# EAGLE design v1-psas-dev-board (EAGLE 6.5.0)

## Sheet 1 of 3: STM
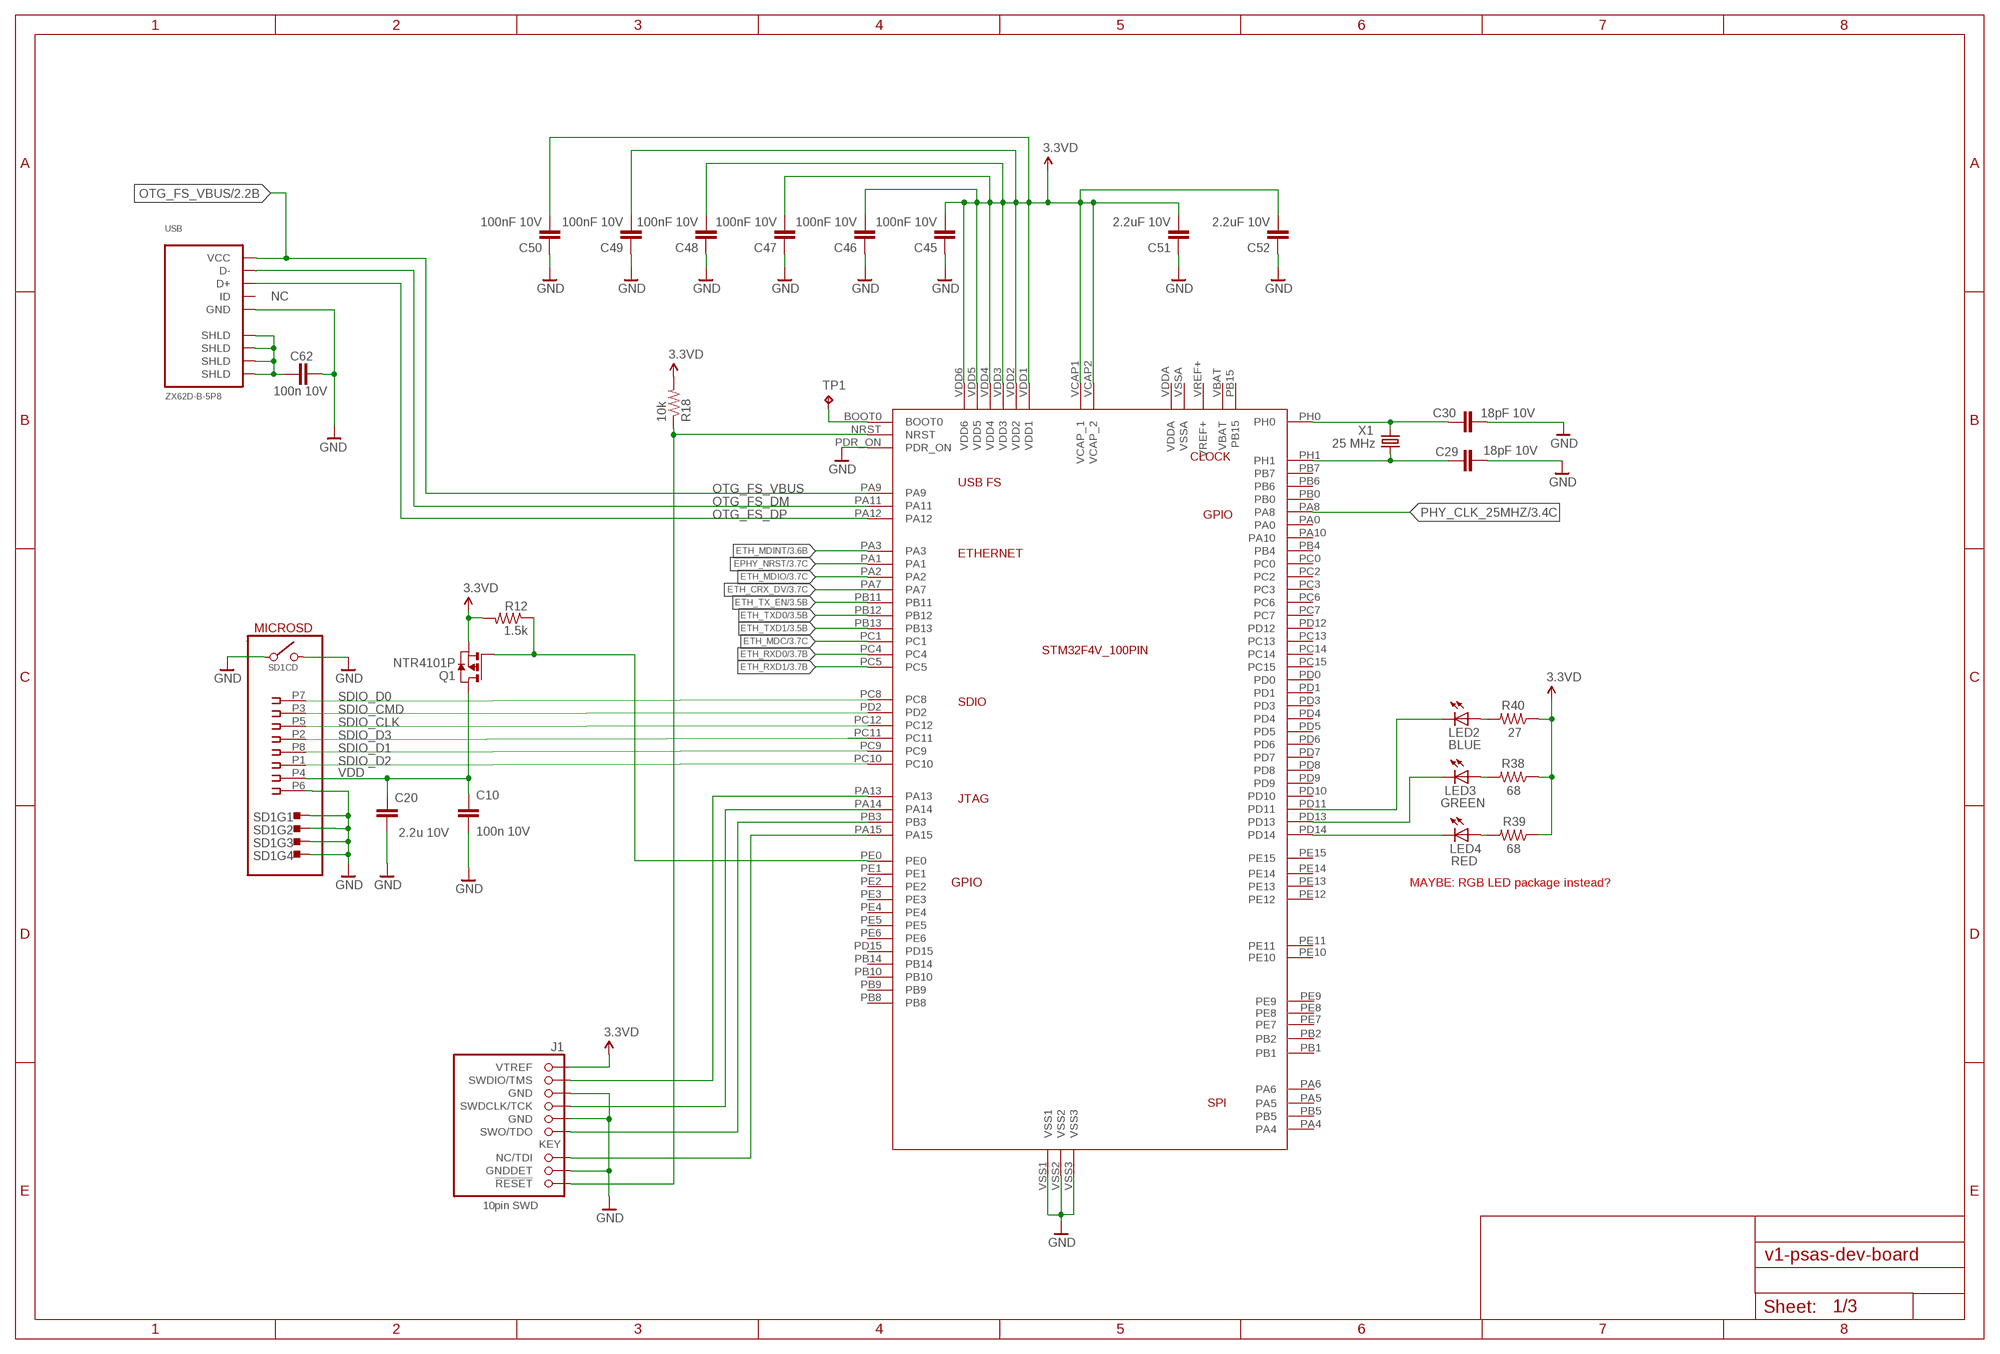
[diagram p0: schematic, sheet 1]

### Parts
C10  100n 10V  C-EU0402-C-NOSILK  [0402-C-NOSILK]
C20  2.2u 10V  C-EU0603-C-NOSILK  [0603-C-NOSILK]
C29  18pF 10V  C-EU0402-C-NOSILK  [0402-C-NOSILK]
C30  18pF 10V  C-EU0402-C-NOSILK  [0402-C-NOSILK]
C45  100nF 10V  C-EU0402-C-NOSILK  [0402-C-NOSILK]
C46  100nF 10V  C-EU0402-C-NOSILK  [0402-C-NOSILK]
C47  100nF 10V  C-EU0402-C-NOSILK  [0402-C-NOSILK]
C48  100nF 10V  C-EU0402-C-NOSILK  [0402-C-NOSILK]
C49  100nF 10V  C-EU0402-C-NOSILK  [0402-C-NOSILK]
C50  100nF 10V  C-EU0402-C-NOSILK  [0402-C-NOSILK]
C51  2.2uF 10V  C-EU0603-C-NOSILK  [0603-C-NOSILK]
C52  2.2uF 10V  C-EU0603-C-NOSILK  [0603-C-NOSILK]
C62  100n 10V  C-EU0402-C-NOSILK  [0402-C-NOSILK]
J1  1.27MM-SWD-CONNECTOR  [1.27MM_2X5]
LED2  BLUE  LEDCHIP-LED0603  [CHIP-LED0603]
LED3  GREEN  LEDCHIP-LED0603  [CHIP-LED0603]
LED4  RED  LEDCHIP-LED0603  [CHIP-LED0603]
Q1  NTR4101P  [SOT23]
R12  1.5k  R-US_0402-C-NOSILK  [0402-C-NOSILK]
R18  10k  R-US_0402-C-NOSILK  [0402-C-NOSILK]
R38  68  R-US_0402-C-NOSILK  [0402-C-NOSILK]
R39  68  R-US_0402-C-NOSILK  [0402-C-NOSILK]
R40  27  R-US_0402-C-NOSILK  [0402-C-NOSILK]
SD1  CON_HIROSE_DM3D(MICROSD)  [HIROSE_DM3D(MICRO-SD)]
TP1  TPTP06R  [TP06R]
U8  STM32F4V  STM32F4V_100PIN_GPSBOARD  [LQFP100]
USB  ZX62D-B-5P8  [ZX62D-B-5P8]
X1  25 MHz  CRYSTALCTS406  [CTS406]

### Nets
3.3VD: C45.2 C46.2 C47.2 C48.2 C49.2 C50.2 C51.2 C52.2 J1.VTREF Q1.2(S) R12.2 R18.2 R38.1 R39.1 R40.1 U8.VCAP1(VCAP_1) U8.VCAP2(VCAP_2) U8.VDD1 U8.VDD2 U8.VDD3 U8.VDD4 U8.VDD5 U8.VDD6 ; also sheet 2,3
!RST: J1.!RESET R18.1 U8.NRST
EPHY_NRST: U8.PA1 ; also sheet 3
ETH_CRX_DV: U8.PA7 ; also sheet 3
ETH_MDC: U8.PC1 ; also sheet 3
ETH_MDINT: U8.PA3 ; also sheet 3
ETH_MDIO: U8.PA2 ; also sheet 3
ETH_RXD0: U8.PC4 ; also sheet 3
ETH_RXD1: U8.PC5 ; also sheet 3
ETH_TX_EN: U8.PB11 ; also sheet 3
ETH_TXD0: U8.PB12 ; also sheet 3
ETH_TXD1: U8.PB13 ; also sheet 3
GND: C10.1 C20.1 C29.1 C30.1 C45.1 C46.1 C47.1 C48.1 C49.1 C50.1 C51.1 C52.1 C62.1 J1.GND J1.GND@2(GND) J1.GNDDET SD1.G1(PAD) SD1.G2(PAD) SD1.G3(PAD) SD1.G4(PAD) SD1.P6 SD1.S0 SD1.S1 U8.PDR_ON U8.VSS1 U8.VSS2 U8.VSS3 USB.P5(GND) ; also sheet 2,3
LED2: LED2.C U8.PD11
LED3: LED3.C U8.PD13
LED4: LED4.C U8.PD14
N$2: LED4.A R39.2
N$3: LED3.A R38.2
N$4: LED2.A R40.2
N$9: TP1.TP U8.BOOT0
OSC_IN: C30.2 U8.PH0 X1.3
OSC_OUT: C29.2 U8.PH1 X1.1
OTG_FS_DM: U8.PA11 USB.P2(D-)
OTG_FS_DP: U8.PA12 USB.P3(D+)
OTG_FS_VBUS: U8.PA9 USB.P1(VCC) ; also sheet 2
PE0: Q1.1(G) R12.1 U8.PE0
PHY_CLK_25MHZ: U8.PA8 ; also sheet 3
SDIO_CLK: SD1.P5 U8.PC12
SDIO_CMD: SD1.P3 U8.PD2
SDIO_D0: SD1.P7 U8.PC8
SDIO_D1: SD1.P8 U8.PC9
SDIO_D2: SD1.P1 U8.PC10
SDIO_D3: SD1.P2 U8.PC11
SHLD: C62.2 USB.P$1(SHLD) USB.P$2(SHLD) USB.P$3(SHLD) USB.P$4(SHLD)
TCK: J1.SWDCLK(SWDCLK/TCK) U8.PA14
TDI: J1.NC(NC/TDI) U8.PA15
TDO: J1.SWO(SWO/TDO) U8.PB3
TMS: J1.SWDIO(SWDIO/TMS) U8.PA13
VDD: C10.2 C20.2 Q1.3(D) SD1.P4
Unconnected: U8.PA0 U8.PA4 U8.PA5 U8.PA6 U8.PA10 U8.PB0 U8.PB1 U8.PB2 U8.PB4 U8.PB5 U8.PB6 U8.PB7 U8.PB8 U8.PB9 U8.PB10 U8.PB14 U8.PB15 U8.PC0 U8.PC2 U8.PC3 U8.PC6 U8.PC7 U8.PC13 U8.PC14 U8.PC15 U8.PD0 U8.PD1 U8.PD3 U8.PD4 U8.PD5 U8.PD6 U8.PD7 U8.PD8 U8.PD9 U8.PD10 U8.PD12 U8.PD15 U8.PE1 U8.PE2 U8.PE3 U8.PE4 U8.PE5 U8.PE6 U8.PE7 U8.PE8 U8.PE9 U8.PE10 U8.PE11 U8.PE12 U8.PE13 U8.PE14 U8.PE15 U8.VBAT U8.VDDA U8.VREF+ U8.VSSA USB.P4(ID)

### Notes on the sheet
- NC
- MICROSD
- MAYBE: RGB LED package instead?

## Sheet 2 of 3: PWR
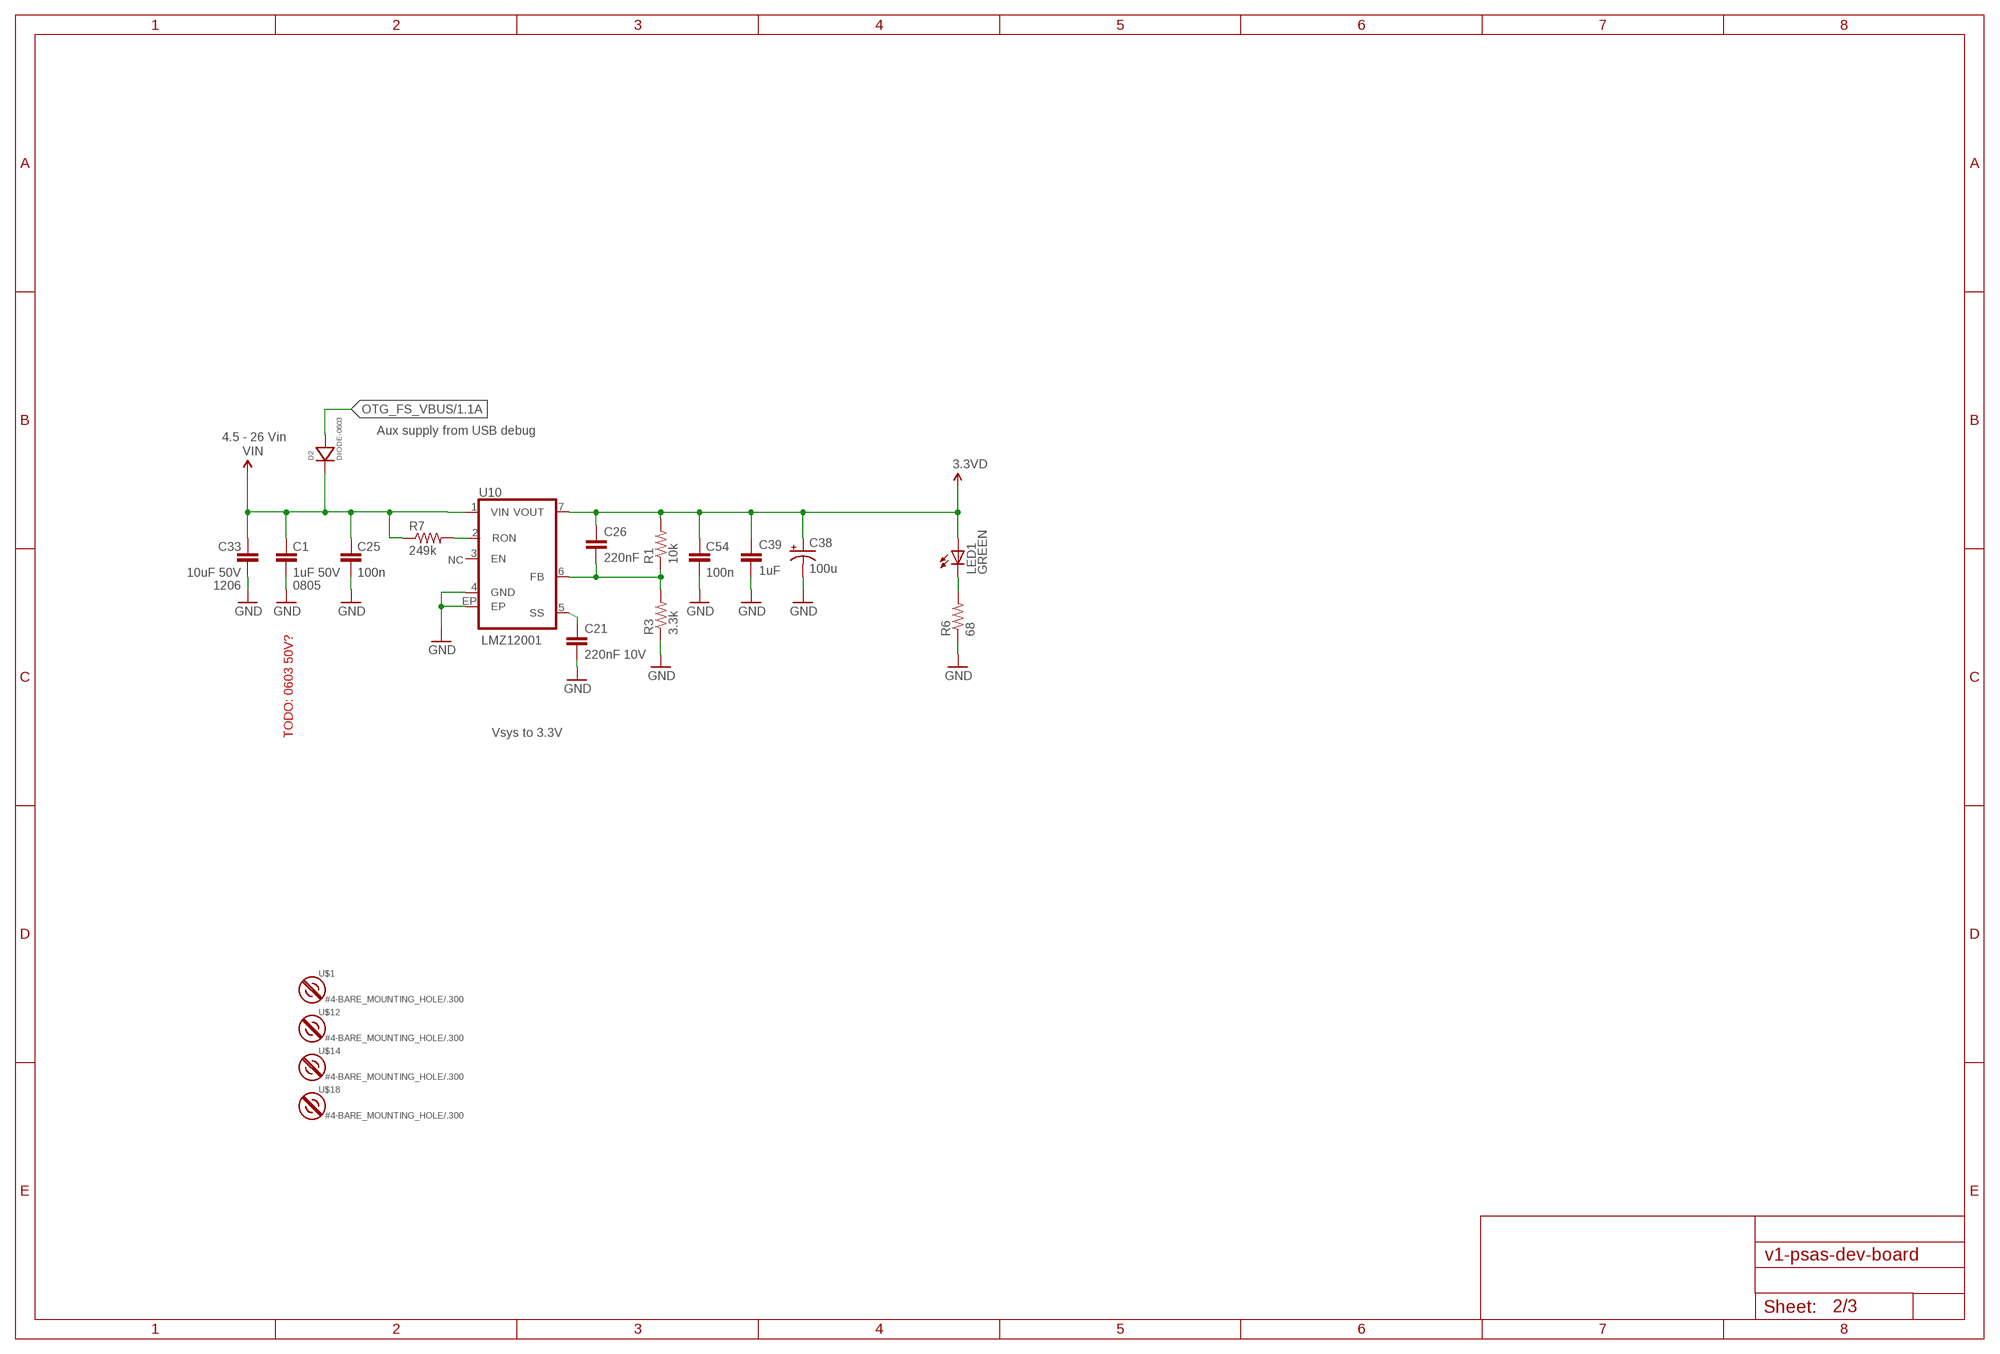
[diagram p1: schematic, sheet 2]

### Parts
C1  1uF 50V  C-EU0805-B-NOSILK  [0805-B-NOSILK]
C21  220nF 10V  C-EU0402-C-NOSILK  [0402-C-NOSILK]
C25  100n  C-EU0402-B-NOSILK  [0402-B-NOSILK]
C26  220nF  C-EU0402-C-NOSILK  [0402-C-NOSILK]
C33  10uF 50V  C-EU1206-C  [1206-C]
C38  100u  CAP_POL6032  [EIA6032]
C39  1uF  C-EU0603-B-NOSILK  [0603-B-NOSILK]
C54  100n  C-EU0402-B-NOSILK  [0402-B-NOSILK]
D2  DIODE-0603  [0603-B-NOSILK-DIODE]
LED1  GREEN  LEDCHIP-LED0603  [CHIP-LED0603]
R1  10k  R-US_0402-C-NOSILK  [0402-C-NOSILK]
R3  3.3k  R-US_0402-C-NOSILK  [0402-C-NOSILK]
R6  68  R-US_0402-C-NOSILK  [0402-C-NOSILK]
R7  249k  R-US_0402-C-NOSILK  [0402-C-NOSILK]
U10  LMZ12001  [TO-PMOD-7]
U$1  #4-BARE_MOUNTING_HOLE/.300  [#4/.300-BARE+STD_NUT_OR_STAR_WASHER]
U$12  #4-BARE_MOUNTING_HOLE/.300  [#4/.300-BARE+STD_NUT_OR_STAR_WASHER]
U$14  #4-BARE_MOUNTING_HOLE/.300  [#4/.300-BARE+STD_NUT_OR_STAR_WASHER]
U$18  #4-BARE_MOUNTING_HOLE/.300  [#4/.300-BARE+STD_NUT_OR_STAR_WASHER]

### Nets
3.3VD: C26.1 C38.P$1(+) C39.1 C54.1 LED1.A R1.2 U10.7(VOUT) ; also sheet 1,3
GND: C1.2 C21.2 C25.2 C33.2 C38.P$2(-) C39.2 C54.2 R3.1 R6.1 U10.4(GND) U10.EP ; also sheet 1,3
N$6: C21.1 U10.5(SS)
N$7: C26.2 R1.1 R3.2 U10.6(FB)
N$10: R7.2 U10.2(RON)
N$19: LED1.C R6.2
OTG_FS_VBUS: D2.ANODE ; also sheet 1
VIN: C1.1 C25.1 C33.1 D2.CATHODE R7.1 U10.1(VIN) ; also sheet 3
Unconnected: U10.3(EN)

### Notes on the sheet
- Aux supply from USB debug
- 4.5 - 26 Vin
- NC
- 1206 | 0805
- TODO: 0603 50V? | Vsys to 3.3V

## Sheet 3 of 3: ETH
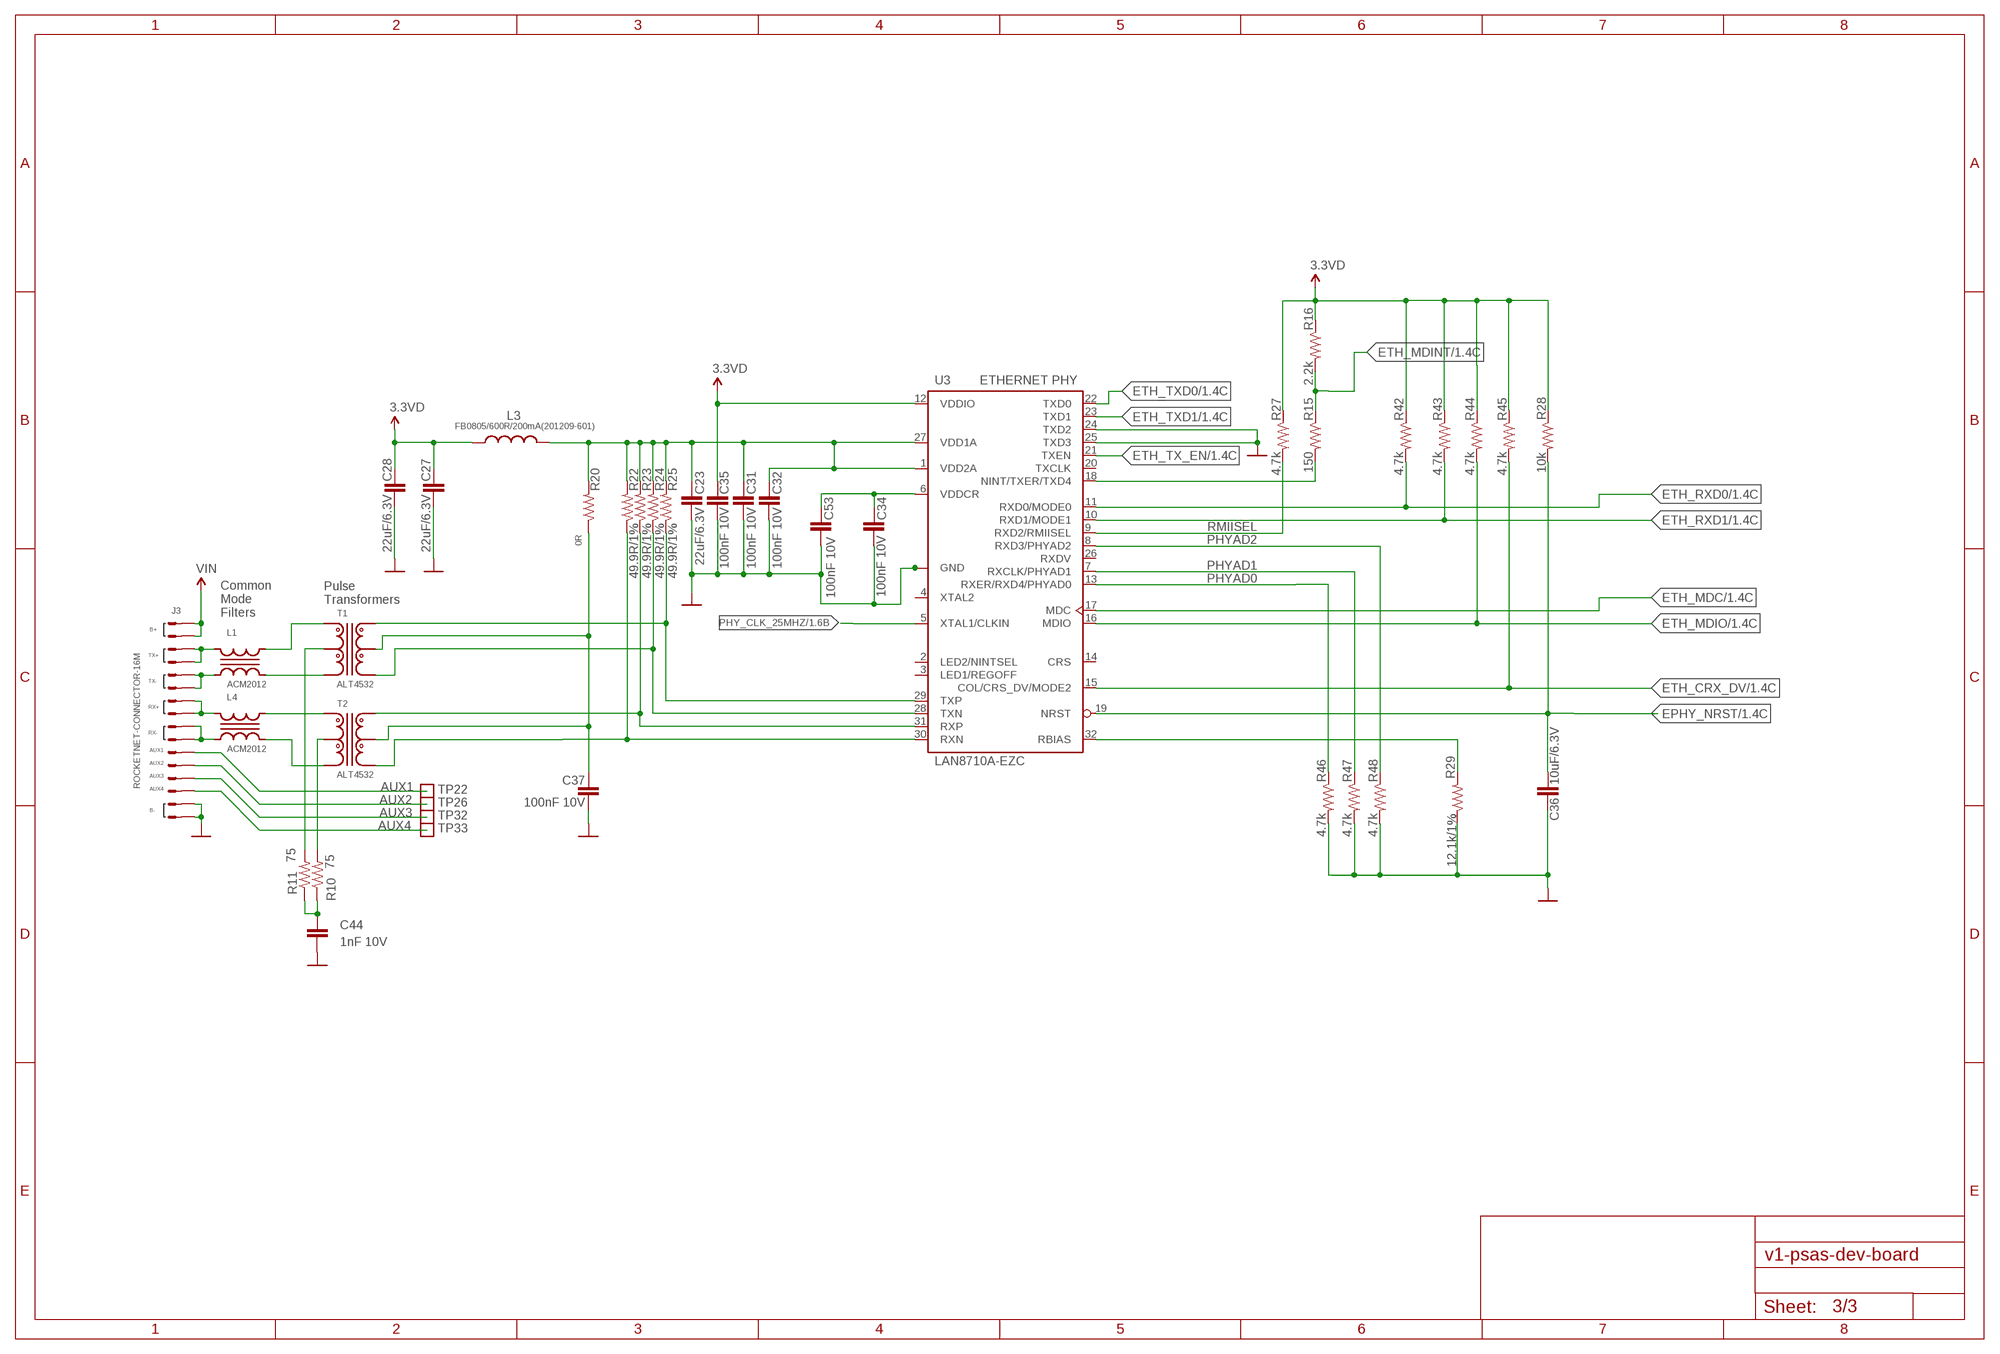
[diagram p2: schematic, sheet 3]

### Parts
C23  22uF/6.3V  C-EU1206-C  [1206-C]
C27  22uF/6.3V  C-EU1206-C  [1206-C]
C28  22uF/6.3V  C-EU1206-C  [1206-C]
C31  100nF 10V  C-EU0402-C-NOSILK  [0402-C-NOSILK]
C32  100nF 10V  C-EU0402-C-NOSILK  [0402-C-NOSILK]
C34  100nF 10V  C-EU0402-C-NOSILK  [0402-C-NOSILK]
C35  100nF 10V  C-EU0402-C-NOSILK  [0402-C-NOSILK]
C36  10uF/6.3V  C-EU1206-C  [1206-C]
C37  100nF 10V  C-EU0402-C-NOSILK  [0402-C-NOSILK]
C44  1nF 10V  C-EU0402-C-NOSILK  [0402-C-NOSILK]
C53  100nF 10V  C-EU0402-C-NOSILK  [0402-C-NOSILK]
J3  ROCKETNET-CONNECTOR-16M  [ROCKETNET-M-16]
L1  ACM2012  [TDK-ACM2012]
L3  FB0805/600R/200mA(201209-601)  L-US0805-C-NOSILK  [0805-C-NOSILK]
L4  ACM2012  [TDK-ACM2012]
R10  75  R-US_0402-C-NOSILK  [0402-C-NOSILK]
R11  75  R-US_0402-C-NOSILK  [0402-C-NOSILK]
R15  150  R-US_0402-C-NOSILK  [0402-C-NOSILK]
R16  2.2k  R-US_0402-C-NOSILK  [0402-C-NOSILK]
R20  0R  R-US_0402-C-NOSILK  [0402-C-NOSILK]
R22  49.9R/1%  R-US_0402-C-NOSILK  [0402-C-NOSILK]
R23  49.9R/1%  R-US_0402-C-NOSILK  [0402-C-NOSILK]
R24  49.9R/1%  R-US_0402-C-NOSILK  [0402-C-NOSILK]
R25  49.9R/1%  R-US_0402-C-NOSILK  [0402-C-NOSILK]
R27  4.7k  R-US_0402-C-NOSILK  [0402-C-NOSILK]
R28  10k  R-US_0402-C-NOSILK  [0402-C-NOSILK]
R29  12.1k/1%  R-US_0402-C-NOSILK  [0402-C-NOSILK]
R42  4.7k  R-US_0402-C-NOSILK  [0402-C-NOSILK]
R43  4.7k  R-US_0402-C-NOSILK  [0402-C-NOSILK]
R44  4.7k  R-US_0402-C-NOSILK  [0402-C-NOSILK]
R45  4.7k  R-US_0402-C-NOSILK  [0402-C-NOSILK]
R46  4.7k  R-US_0402-C-NOSILK  [0402-C-NOSILK]
R47  4.7k  R-US_0402-C-NOSILK  [0402-C-NOSILK]
R48  4.7k  R-US_0402-C-NOSILK  [0402-C-NOSILK]
T1  ALT4532  [TDK-ALT4532]
T2  ALT4532  [TDK-ALT4532]
TP22  TEST-POINT  [2MM-TEST-POINT]
TP26  TEST-POINT  [2MM-TEST-POINT]
TP32  TEST-POINT  [2MM-TEST-POINT]
TP33  TEST-POINT  [2MM-TEST-POINT]
U3  LAN8710A-EZC  [QFN-32(DRILLS)]

### Nets
3.3VD: C27.2 C28.2 C35.1 L3.2 R16.1 R27.1 R28.1 R42.1 R43.1 R44.1 R45.1 U3.12(VDDIO) ; also sheet 1,2
AUX1: J3.A1(AUX1) TP22.1
AUX2: J3.A2(AUX2) TP26.1
AUX3: J3.A3(AUX3) TP32.1
AUX4: J3.A4(AUX4) TP33.1
EPHY_NRST: C36.2 R28.2 U3.19(NRST) ; also sheet 1
ETH_CRX_DV: R45.2 U3.15(COL/CRS_DV/MODE2) ; also sheet 1
ETH_MDC: U3.17(MDC) ; also sheet 1
ETH_MDINT: R15.1 R16.2 ; also sheet 1
ETH_MDIO: R44.2 U3.16(MDIO) ; also sheet 1
ETH_RXD0: R42.2 U3.11(RXD0/MODE0) ; also sheet 1
ETH_RXD1: R43.2 U3.10(RXD1/MODE1) ; also sheet 1
ETH_TX_EN: U3.21(TXEN) ; also sheet 1
ETH_TXD0: U3.22(TXD0) ; also sheet 1
ETH_TXD1: U3.23(TXD1) ; also sheet 1
GND: C23.1 C27.1 C28.1 C31.1 C32.1 C34.1 C35.2 C36.1 C37.1 C44.1 C53.1 J3.B-@1(B-) J3.B-@2(B-) R29.1 R46.2 R47.2 R48.2 U3.24(TXD2) U3.25(TXD3) U3.GND ; also sheet 1,2
N$8: J3.T+@13(TX+) J3.T+@14(TX+) L1.1
N$15: C44.2 R10.1 R11.1
N$20: J3.T-@9(TX-) J3.T-@11(TX-) L1.2
N$26: J3.R+@5(RX+) J3.R+@7(RX+) L4.1
N$27: J3.R-@3(RX-) J3.R-@4(RX-) L4.2
N$28: L1.4 T1.1
N$29: L1.3 T1.2
N$30: L4.4 T2.1
N$31: L4.3 T2.2
N$32: R11.2 T1.6
N$33: R10.2 T2.6
N$40: R22.1 T2.4 U3.30(RXN)
N$41: R25.1 T1.5 U3.29(TXP)
N$42: R24.1 T1.4 U3.28(TXN)
N$44: R23.1 T2.5 U3.31(RXP)
N$55: R29.2 U3.32(RBIAS)
N$56: C37.2 R20.1 T1.3 T2.3
N$58: C34.2 C53.2 U3.6(VDDCR)
N$63: R15.2 U3.18(NINT/TXER/TXD4)
PHY_CLK_25MHZ: U3.5(XTAL1/CLKIN) ; also sheet 1
PHYAD0: R46.1 U3.13(RXER/RXD4/PHYAD0)
PHYAD1: R47.1 U3.7(RXCLK/PHYAD1)
PHYAD2: R48.1 U3.8(RXD3/PHYAD2)
RMIISEL: R27.2 U3.9(RXD2/RMIISEL)
VDDA: C23.2 C31.2 C32.2 L3.1 R20.2 R22.2 R23.2 R24.2 R25.2 U3.1(VDD2A) U3.27(VDD1A)
VIN: J3.B+@15(B+) J3.B+@16(B+) ; also sheet 2
Unconnected: U3.2(LED2/NINTSEL) U3.3(LED1/REGOFF) U3.4(XTAL2) U3.14(CRS) U3.20(TXCLK) U3.26(RXDV)

### Notes on the sheet
- ETHERNET PHY
- Pulse
  Transformers
- Common 
  Mode
  Filters
- The PHY is setted up as follows:
- MODE: All capable(10/100Base).
- Auto-negotiation enabled.
- RMII Configuration
- SMI address: 0x00

## Library data of the parts
C1 C10 C20 C21 C23 C25-C37 C39 C44-C54 C62 = rcl_custom:C-EU: CAPACITOR, European symbol
C38 = SparkFun-Passives:CAP_POL: Capacitor Polarized These are standard SMD and PTH capacitors. Normally 10uF, 47uF, and 100uF in electrolytic and tantalum varieties. Always verify the external diameter of the through hole cap, it varies with capacity, voltage, and manufacturer. The EIA devices should be standard.
D2 = diode-0603:DIODE-0603
J1 = con-swd:1.27MM-SWD-CONNECTOR
J3 = rocketnet-connector:ROCKETNET-CONNECTOR-16
L1 L4 = magnetics:ACM2012
L3 = rcl_custom:L-US: INDUCTOR, American symbol
LED1-LED4 = led:LED: LED OSRAM: - CHIPLED LG R971, LG N971, LY N971, LG Q971, LY Q971, LO R971, LY R971 LH N974, LH R974 LS Q976, LO Q976, LY Q976 LO Q996 - Hyper CHIPLED LW Q18S LB Q993, LB Q99A, LB R99A - SideLED LS A670, LO A670, LY A670, LG A670, LP A670 LB A673, LV A673, LT A673, LW A673 LH A674 LY A675 LS A676, LA A676, LO A676, LY A676, LW A676 LS A679, LY A679, LG A679 - Hyper Micro SIDELED® LS Y876, LA Y876, LO Y876, LY Y876 LT Y87S - SmartLED LW L88C, LW L88S LB L89C, LB L89S, LG L890 LS L89K, LO L89K, LY L89K LS L896, LA L896, LO L896, LY L896 - TOPLED LS T670, LO T670, LY T670, LG T670, LP T670 LSG T670, LSP T670, LSY T670, LOP T670, LYG T670 LG T671, LOG T671, LSG T671 LB T673, LV T673, LT T673, LW T673 LH T674 LS T676, LA T676, LO T676, LY T676, LB T676, LH T676, LSB T676, LW T676 LB T67C, LV T67C, LT T67C, LS T67K, LO T67K, LY T67K, LW E67C LS E67B, LA E67B, LO E67B, LY E67B, LB E67C, LV E67C, LT E67C LW T67C LS T679, LY T679, LG T679 LS T770, LO T770, LY T770, LG T770, LP T770 LB T773, LV T773, LT T773, LW T773 LH T774 LS E675, LA E675, LY E675, LS T675 LS T776, LA T776, LO T776, LY T776, LB T776 LHGB T686 LT T68C, LB T68C - Hyper Mini TOPLED® LB M676 - Mini TOPLED Santana® LG M470 LS M47K, LO M47K, LY M47K Source: http://www.osram.convergy.de LUXEON: - LUMILED® LXK2-PW12-R00, LXK2-PW12-S00, LXK2-PW14-U00, LXK2-PW14-V00 LXK2-PM12-R00, LXK2-PM12-S00, LXK2-PM14-U00 LXK2-PE12-Q00, LXK2-PE12-R00, LXK2-PE12-S00, LXK2-PE14-T00, LXK2-PE14-U00 LXK2-PB12-K00, LXK2-PB12-L00, LXK2-PB12-M00, LXK2-PB14-N00, LXK2-PB14-P00, LXK2-PB14-Q00 LXK2-PR12-L00, LXK2-PR12-M00, LXK2-PR14-Q00, LXK2-PR14-R00 LXK2-PD12-Q00, LXK2-PD12-R00, LXK2-PD12-S00 LXK2-PH12-R00, LXK2-PH12-S00 LXK2-PL12-P00, LXK2-PL12-Q00, LXK2-PL12-R00 Source: www.luxeon.com KINGBRIGHT: KA-3528ASYC Source: www.kingbright.com
Q1 = Tova:NTR4101P
R1 R3 R6 R7 R10-R12 R15 R16 R18 R20 R22-R25 R27-R29 R38-R40 R42-R48 = rcl_custom:R-US_: RESISTOR, American symbol
SD1 = con-usd-hirose-dm3-gpsboard:CON_HIROSE_DM3*: Hirose μSD card socket without ejection mechanism. Approx 12x12 mm
T1 T2 = magnetics:ALT4532
TP1 = testpad:TP: Test pad
TP22 TP26 TP32 TP33 = Tova:TEST-POINT
U3 = OLIMEX_IC:LAN8710A: LAN8710A/LAN8710Ai Small Footprint MII/RMII 10/100 Ethernet Transceiver with HP Auto-MDIX and flexPWR® Technology
U8 = stm32f4:STM32F4V_100PIN_GPSBOARD: Custom symbol of 100-pin STM32F407 for GPS RF front-end board. Standard LQFP100 package.
U10 = SparkFun-PowerIC:LMZ12001
U$1 U$12 U$14 U$18 = mount:#4-BARE_MOUNTING_HOLE: 1/8" drill hole for #4 screw mount
USB = con-hirose-microusb:ZX62D-B-5P8
X1 = crystal:CRYSTAL: CRYSTAL; OC_FARNELL: unknown; OC_NEWARK: unknown

## Net classes
2 thin: width 0.025 mm, clearance 0.025 mm

## Board
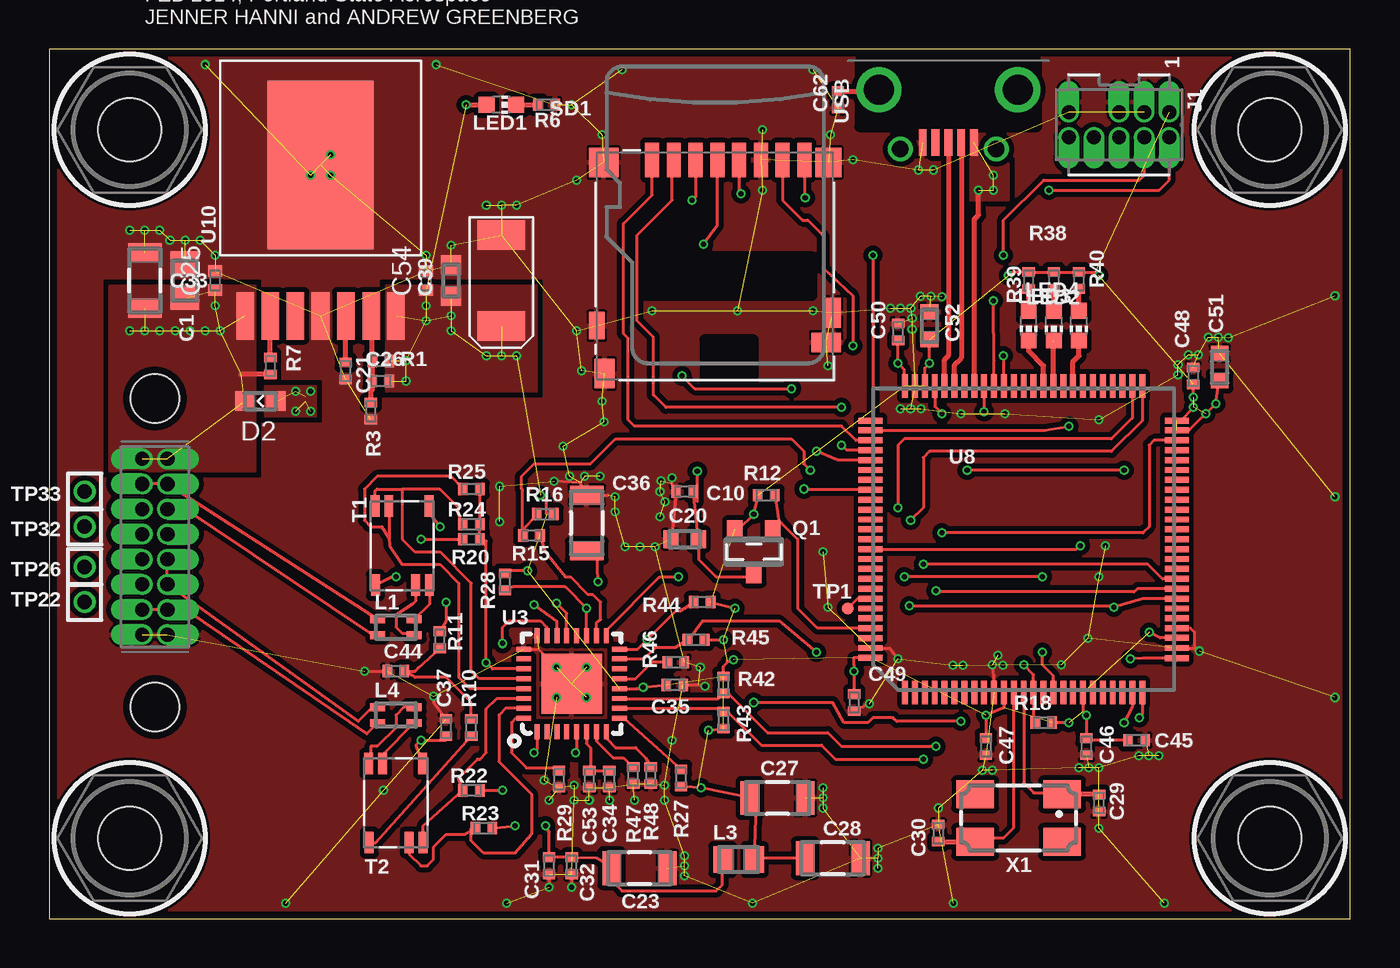
[diagram p3: board, top side]
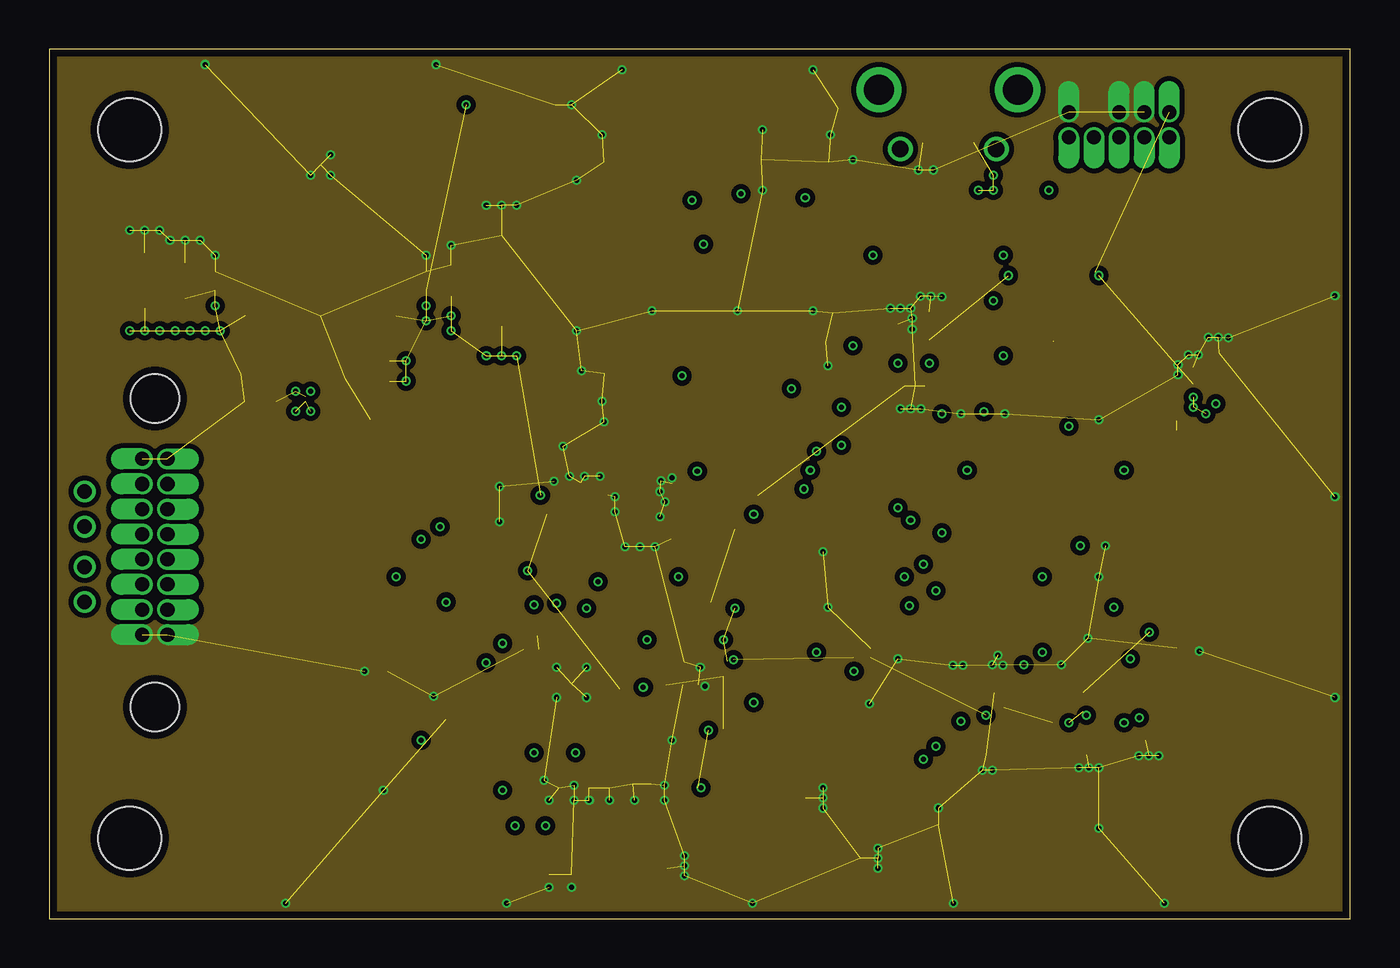
[diagram p4: board, inner layer GND]
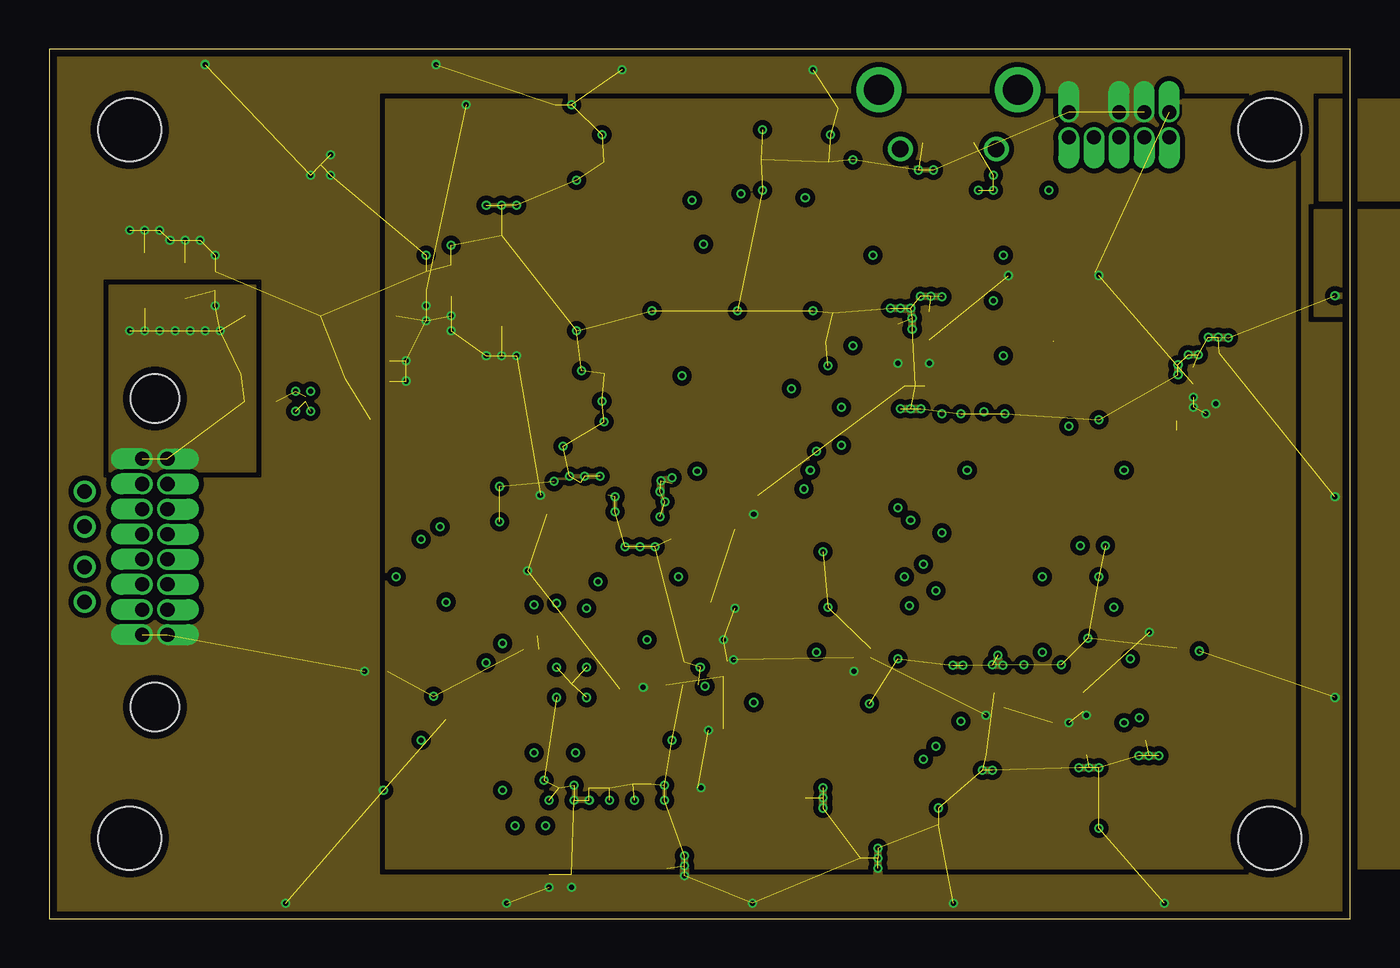
[diagram p5: board, inner layer SUPPLY]
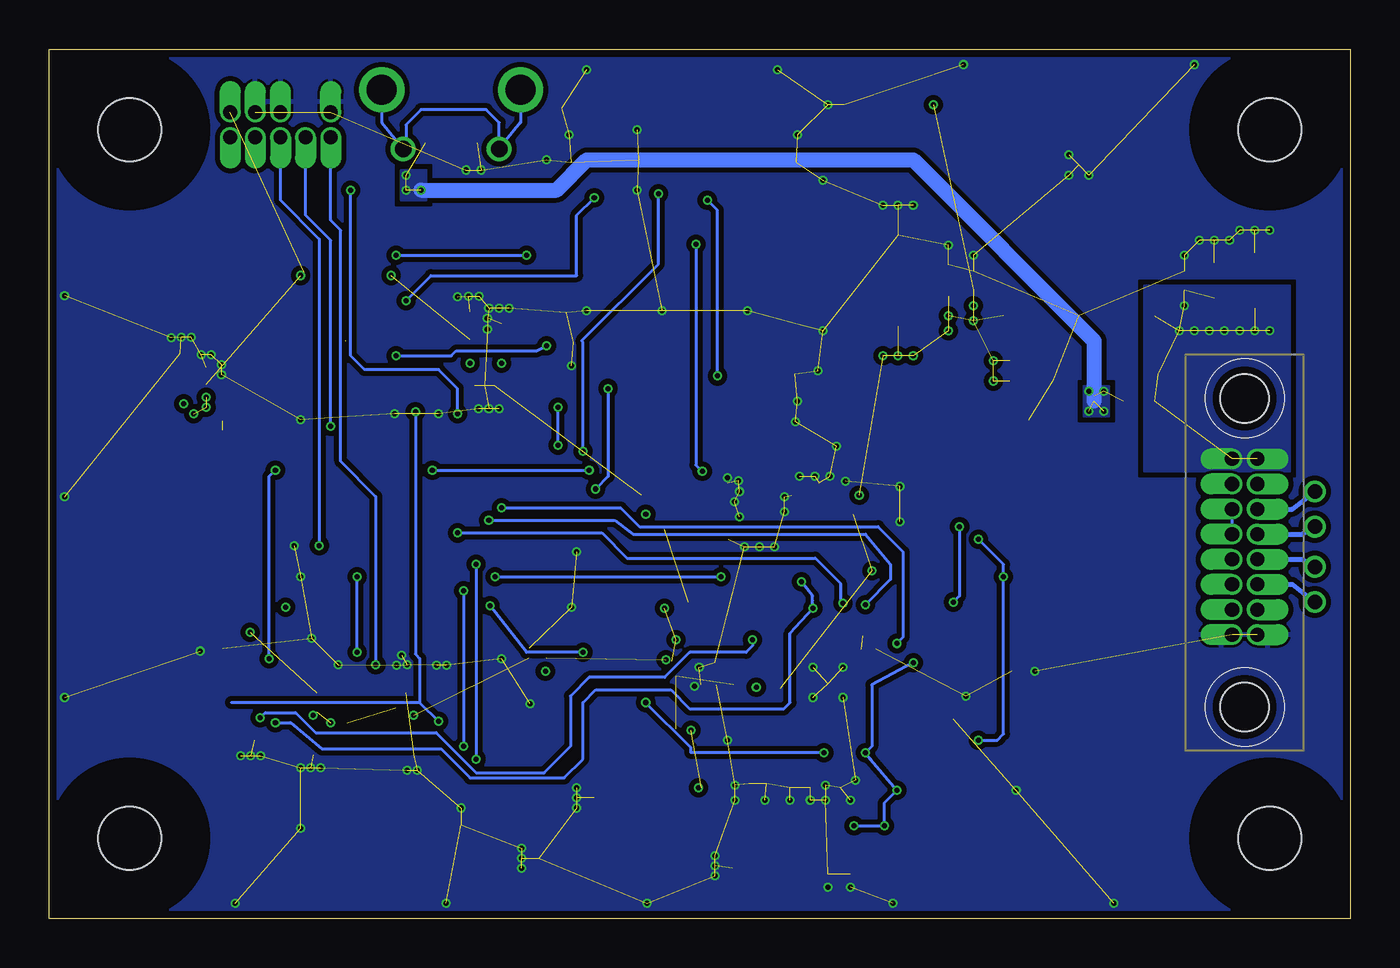
[diagram p6: board, bottom side, seen from below]

Size 65.79 x 43.94 mm. Coordinates in mm from the lower left corner, seen from the top.
Outline: 0,0 65.79,0 65.79,43.94 0,43.94 0,0
Copper layers (1+2*15+16): Top 0.035559375mm / dielectric 0.17018125mm / GND 0.01778125mm / dielectric 47mil / SUPPLY 0.01778125mm / dielectric 0.17018125mm / Bottom 0.035559375mm
Design rules "osh-park-4layer": minimum track width 5mil, minimum drill 10mil, track to track 5mil, track to pad 5mil, pad to pad 5mil, via to via 5mil, smd to smd 5mil, copper to edge 15mil, drill to drill 5mil, minimum pad ring 7mil, minimum via ring 4mil, stop-mask expansion 3mil, vias tented up to drill 0mil, thermal gap 5mil

### Footprints (pad centres in the part's own frame; a part is rotated, then mirrored left to right if it is on the bottom)
0805-B-NOSILK = smd 1.15 x 1.45: 1 -0.9,0; 2 0.9,0
0402-C-NOSILK = smd 0.49 x 0.62: 1 -0.43,0; 2 0.43,0
0603-C-NOSILK = smd 0.75 x 0.9: 1 -0.7,0; 2 0.7,0
1206-C = smd 0.95 x 1.7: 1 -1.4,0; 2 1.4,0
0402-B-NOSILK = smd 0.59 x 0.72: 1 -0.48,0; 2 0.48,0
EIA6032 = smd 1.5 x 2.4: P$1 -2.3,0; P$2 2.3,0
0603-B-NOSILK = smd 0.95 x 1: 1 -0.8,0; 2 0.8,0
0603-B-NOSILK-DIODE = smd 0.95 x 1: ANODE -0.8,0; CATHODE 0.8,0
1.27MM_2X5 = drill 0.7 pad 1.016 offset: !RESET 0.635,-2.54; GND -0.635,1.27; GND@2 -0.635,0; GNDDET -0.635,-2.54; NC 0.635,-1.27; SWDCLK 0.635,1.27; SWDIO 0.635,2.54; SWO 0.635,0; VTREF -0.635,2.54
ROCKETNET-M-16 = drill 0.71 pad 0.95 offset: A1 -1.905,0.635; A2 -0.635,0.635; A3 0.635,0.635; A4 1.905,0.635; B+@15 4.445,-0.635; B+@16 4.445,0.635; B-@1 -4.445,-0.635; B-@2 -4.445,0.635; R+@5 -1.905,-0.635; R+@7 -0.635,-0.635; R-@3 -3.175,-0.635; R-@4 -3.175,0.635; T+@13 3.175,-0.635; T+@14 3.175,0.635; T-@9 0.635,-0.635; T-@11 1.905,-0.635 | hole 2.438: 7.5,0; -8.1,0
TDK-ACM2012 = smd 0.75 x 0.4: 1 -0.925,0.4; 2 -0.925,-0.4; 3 0.925,-0.4; 4 0.925,0.4
0805-C-NOSILK = smd 0.95 x 1.35: 1 -0.8,0; 2 0.8,0
CHIP-LED0603 = smd 0.8 x 0.8: A 0,-0.75; C 0,0.75
SOT23 = smd 0.787 x 0.889: 1 -0.953,-1.143; 2 0.953,-1.143; 3 0,1.143
HIROSE_DM3D(MICRO-SD) = smd 1.5 x 1.5: G1 -7.782,10.035 | smd 1.3 x 1.5: G2 3.593,10.035 | smd 0.8 x 1.5: G3 3.818,2.435 | smd 0.8 x 1.4: G4 -8.132,1.785 | smd 0.7 x 1.75: P1 -5.332,10.16; P2 -4.232,10.16; P3 -3.132,10.16; P4 -2.032,10.16; P5 -0.932,10.16; P6 0.168,10.16; P7 1.268,10.16; P8 2.368,10.16 | smd 1.5 x 1: S0 3.468,0.935 | smd 1 x 1.5: S1 -7.732,-0.64
TDK-ALT4532 = smd 1.1 x 0.45: 1 -2,-1.375; 2 -2,-0.675; 3 -2,1.35; 4 2,1.375; 5 2,0.675; 6 2,-1.35
TP06R = smd 0.6 x 0.6: TP 0,0
2MM-TEST-POINT = drill 0.737: 1 0,0
QFN-32(DRILLS) = smd 0.25 x 0.75: 1 -1.75,-2.425; 2 -1.25,-2.425; 3 -0.75,-2.425; 4 -0.25,-2.425; 5 0.25,-2.425; 6 0.75,-2.425; 7 1.25,-2.425; 8 1.75,-2.425; 17 1.75,2.425; 18 1.25,2.425; 19 0.75,2.425; 20 0.25,2.425; 21 -0.25,2.425; 22 -0.75,2.425; 23 -1.25,2.425; 24 -1.75,2.425 | smd 0.75 x 0.25: 9 2.425,-1.75; 10 2.425,-1.25; 11 2.425,-0.75; 12 2.425,-0.25; 13 2.425,0.25; 14 2.425,0.75; 15 2.425,1.25; 16 2.425,1.75; 25 -2.425,1.75; 26 -2.425,1.25; 27 -2.425,0.75; 28 -2.425,0.25; 29 -2.425,-0.25; 30 -2.425,-0.75; 31 -2.425,-1.25; 32 -2.425,-1.75 | smd 3.048 x 3.048: GND 0,0
LQFP100 = smd 1.2 x 0.3: BOOT0 -7.75,-3; PA3 7.75,-6.016; PA4 7.75,-4.5; PA5 7.75,-4; PA6 7.75,-3.5; PA7 7.75,-3; PA14 -7.75,6; PA15 -7.75,5.5; PB0 7.75,-1.5; PB1 7.75,-1; PB2 7.75,-0.5; PB3 -7.75,-0.5; PB4 -7.75,-1; PB5 -7.75,-1.5; PB6 -7.75,-2; PB7 -7.75,-2.5; PB8 -7.75,-3.5; PB9 -7.75,-4; PB10 7.75,4.5; PB11 7.75,5; PC4 7.75,-2.5; PC5 7.75,-2; PC10 -7.75,5; PC11 -7.75,4.5; PC12 -7.75,4; PD0 -7.75,3.5; PD1 -7.75,3; PD2 -7.75,2.5; PD3 -7.75,2; PD4 -7.75,1.5; PD5 -7.75,1; PD6 -7.75,0.5; PD7 -7.75,0; PDR_ON -7.75,-5.5; PE0 -7.75,-4.5; PE1 -7.75,-5; PE7 7.75,0; PE8 7.75,0.5; PE9 7.75,1; PE10 7.75,1.5; PE11 7.75,2; PE12 7.75,2.5; PE13 7.75,3; PE14 7.75,3.5; PE15 7.75,4; VCAP1 7.75,5.5; VDD3 7.75,-4.984; VDD4 7.75,6; VDD6 -7.75,-6; VSS2 7.75,-5.5 | smd 0.3 x 1.2: NRST 0.5,-7.75; PA0 5,-7.75; PA1 5.5,-7.75; PA2 6,-7.75; PA8 -2,7.75; PA9 -2.5,7.75; PA10 -3,7.75; PA11 -3.5,7.75; PA12 -4,7.75; PA13 -4.5,7.75; PB12 6,7.75; PB13 5.5,7.75; PB14 5,7.75; PB15 4.5,7.75; PC0 1,-7.75; PC1 1.5,-7.75; PC2 2,-7.75; PC3 2.5,-7.75; PC6 0,7.75; PC7 -0.5,7.75; PC8 -1,7.75; PC9 -1.5,7.75; PC13 -3,-7.75; PC14 -2.5,-7.75; PC15 -2,-7.75; PD8 4,7.75; PD9 3.5,7.75; PD10 3,7.75; PD11 2.5,7.75; PD12 2,7.75; PD13 1.5,7.75; PD14 1,7.75; PD15 0.5,7.75; PE2 -6,-7.75; PE3 -5.5,-7.75; PE4 -5,-7.75; PE5 -4.5,-7.75; PE6 -4,-7.75; PH0 -0.5,-7.75; PH1 0,-7.75; VBAT -3.5,-7.75; VCAP2 -5,7.75; VDD1 -1,-7.75; VDD2 3,-7.75; VDD5 -6,7.75; VDDA 4.5,-7.75; VREF+ 4,-7.75; VSS1 -1.5,-7.75; VSS3 -5.5,7.75; VSSA 3.5,-7.75
TO-PMOD-7 = smd 0.89 x 2.41: 1 -3.81,-7.63; 2 -2.54,-7.63; 3 -1.27,-7.63; 4 0,-7.63; 5 1.27,-7.63; 6 2.57,-7.63; 7 3.81,-7.63 | smd 5.35 x 8.54: EP 0,0
#4/.300-BARE+STD_NUT_OR_STAR_WASHER = hole 3.175: 0,0
ZX62D-B-5P8 = smd 0.4 x 1.35: P1 -1.3,2.675; P2 -0.65,2.675; P3 0,2.675; P4 0.65,2.675; P5 1.3,2.675 | drill 1.524: P$1 3.51,0; P$2 -3.51,0 | drill 0.838: P$3 -2.425,3; P$4 2.425,3
CTS406 = smd 1.9 x 1.4: 1 -2.2,-1.2; 2 2.2,-1.2; 3 2.2,1.2; 4 -2.2,1.2

### Placement (x,y rotation side)
C1  6.86,32.26 90 top
C10  32.13,21.59 0 top
C20  32.13,19.18 0 top
C21  14.99,27.69 270 top
C23  29.84,2.54 180 top
C25  8.38,32.26 90 top
C26  16.76,27.18 180 top
C27  36.83,6.1 180 top
C28  39.62,3.05 180 top
C29  53.09,5.84 90 top
C30  44.96,4.32 270 top
C31  25.27,2.67 90 top
C32  26.42,2.67 90 top
C33  4.83,32.26 90 top
C34  28.32,7.05 90 top
C35  31.62,11.81 0 top
C36  27.18,20 270 top
C37  20.07,9.65 270 top
C38  22.86,32.26 90 top
C39  20.32,32.26 90 top
C44  17.53,12.51 0 top
C45  54.99,9.02 180 top
C46  52.45,8.7 90 top
C47  47.37,8.7 90 top
C48  57.85,27.43 270 top
C49  40.7,10.92 90 top
C50  42.93,29.65 270 top
C51  59.18,27.88 270 top
C52  44.51,29.97 270 top
C53  27.3,7.05 90 top
C54  19.05,32.26 90 top
C62  39.88,41.4 90 top
D2  10.67,26.16 180 top
J1  54.1,40.13 270 top
J3  5.33,18.8 90 top
L1  17.53,14.73 0 top
L3  34.86,2.98 0 top
L4  17.53,10.29 0 top
LED1  22.86,41.15 270 top
LED2  52.07,29.97 180 top
LED3  50.8,29.97 180 top
LED4  49.53,29.97 180 top
Q1  35.62,18.54 180 top
R1  16.76,28.19 0 top
R3  16.26,25.65 90 top
R6  25.15,41.15 180 top
R7  11.18,27.94 90 top
R10  21.34,9.65 270 top
R11  19.75,14.1 90 top
R12  36.26,21.4 180 top
R15  24.38,19.37 0 top
R16  25.08,20.45 180 top
R18  50.29,9.91 0 top
R20  21.34,19.18 0 top
R22  21.34,6.48 0 top
R23  21.97,4.57 0 top
R24  21.34,19.94 0 top
R25  21.34,21.72 0 top
R27  31.94,7.11 90 top
R28  23.05,17.02 270 top
R29  25.78,7.05 90 top
R38  50.8,32.26 270 top
R39  49.53,32.26 270 top
R40  52.07,32.26 270 top
R42  34.1,11.81 270 top
R43  34.1,10.03 90 top
R44  33.02,16 180 top
R45  32.7,14.1 180 top
R46  31.69,12.95 0 top
R47  29.53,7.24 270 top
R48  30.42,7.24 270 top
SD1  35.81,28.19 0 top
T1  17.84,18.86 90 top
T2  17.53,5.84 270 top
TP1  40.39,15.68 0 top
TP22  1.78,16 0 top
TP26  1.78,17.78 0 top
TP32  1.78,19.81 0 top
TP33  1.78,21.59 0 top
U3  26.42,11.87 0 top
U8  49.28,19.18 0 top
U10  13.72,38.1 0 top
U$1  4.06,39.88 0 top
U$12  4.06,4.06 0 top
U$14  61.72,4.06 0 top
U$18  61.72,39.88 0 top
USB  45.47,41.91 180 top
X1  49.02,5.08 180 top

### Tracks (layer width: path | path; a pad name or v marks a point on that pad's centre or on a via)
2.85VA
  pour SUPPLY (isolate 0.254, no thermals): 71.63,13.72 73.66,13.72 74.93,14.99 82.04,14.99 82.04,13.72 87.12,13.72 87.12,41.4 64.26,41.4 64.26,36.32 71.63,36.32
2.85VD
  pour SUPPLY (isolate 0.254): 81.53,14.48 75.18,14.48 73.91,13.21 71.12,13.21 71.12,35.81 64.01,35.81 64.01,30.48 66.04,30.48 66.04,2.54 81.53,2.54
3.3VD  (via drill 0.25)  (37 unrouted)
  Top 0.152: U8.VDD4 57.25,25.18 v57.85,25.84 C48.2 | U8.VDD2 52.28,10.46 v52.45,10.29 C46.2 52.78,9.02 C45.2 | U8.VCAP2 44.28,27.83 v44.51,28.07 C52.2 | U8.VDD5 43.28,27.08 43.24,27.11 43.24,27.75 v42.93,28.07 C50.2 | 59.12,26.9 C51.2 59.12,26.96 v58.99,26.04 | 59.02,26.06 v58.99,26.04 | U8.VCAP1 57.63,24.68 v58.99,26.04 | U8.VDD1 48.28,10.65 v47.37,10.29 C47.2 | U8.VDD6 40.67,13.18 v40.7,12.51 C49.2 | U3.12 29.71,11.62 v30.04,11.68 C35.1 | C28.2 35.83,3.05 L3.2 35.76,5.76 C27.2 v32.96,6.6 32.81,6.6 R27.1 | R44.1 v34.67,15.68 | R45.1 v34.1,14.1 | v24.19,17.59 23.13,17.59 R28.1 | R12.2 35.61,20.46 v35.62,20.45 34.86,19.68 Q1.2 | R16.1 25.15,20.45 25.15,21.08 v24.83,21.4 | U8.VDD3 56.16,14.19 v55.63,14.48 | R42.1 34.1,12.76 34.29,12.95 34.29,13.02 v34.61,13.08 | R43.1 33.59,9.53 v33.34,9.53 | v51.56,9.91 R18.2 | v48.51,32.51 48.69,32.69 R39.1 R38.1 R40.1 52.91,32.69 v53.09,32.51
  Top 0.254: v21.08,41.15 LED1.A
  other vias: 58.48,25.53 57.85,26.35 19.05,30.99 19.05,30.23 20.32,29.72 20.32,30.48 23.62,28.45 22.86,28.45 22.1,28.45 18.03,28.19 18.03,27.18
  pour SUPPLY (isolate 0.254): 17.02,2.54 17.02,41.4 62.99,41.4 62.99,2.54
  pour Top (isolate 0.254, no thermals): 17.02,32 17.02,26.67 24.64,26.67 24.64,32
!RST  (via drill 0.25)
  Top 0.152: v49.28,12.83 49.78,12.33 U8.NRST 49.78,9.99 R18.1
  Bottom 0.152: v49.28,12.83 49.28,21.34 51.05,23.11 51.05,34.8 51.56,35.31 J1.!RESET
AUX1
  Bottom 0.254: J3.A1 2.92,16.89 TP22.1
AUX2
  Bottom 0.254: J3.A2 2.41,18.16 TP26.1
AUX3
  Bottom 0.254: J3.A3 2.41,19.43 TP32.1
AUX4
  Bottom 0.254: J3.A4 2.92,20.7 TP33.1
EPHY_NRST  (via drill 0.25)
  Top 0.152: U3.19 v27.17,15.7 26.1,16.76 23.45,16.76 R28.2 | v27.75,17.02 27.69,18.54 C36.2 | U8.PA1 54.78,10.71 v54.36,9.91
  Bottom 0.152: v27.75,17.02 27.19,16.31 27.19,16.08 v27.17,15.7 27.18,15.68 28.32,14.41 28.32,10.92 28.64,10.6 33.4,10.6 34.35,11.56 38.16,11.56 38.8,10.92 38.8,8.06 39.75,7.11 44.51,7.11 45.97,8.57 52.01,8.57 53.59,9.91 v54.36,9.91
ETH_CRX_DV  (via drill 0.25)
  Top 0.152: U3.15 30.08,13.12 30.67,13.72 31.67,13.72 R45.2 32.32,14.1 33.02,15.05 36.89,15.05 v38.8,13.46 | U8.PA7 55.29,16.18 v53.85,15.75 53.91,15.81 v43.5,15.81
  Bottom 0.152: v38.8,13.46 41.66,13.46 v43.5,15.81
ETH_MDC  (via drill 0.25)
  Top 0.152: U8.PC1 50.78,12.28 50.23,12.83 v50.23,13.46 | v50.23,17.27 v43.24,17.27 | U3.17 28.17,14.58 30.86,17.27 v31.81,17.27
  Bottom 0.152: v50.23,13.46 v50.23,17.27 | v43.24,17.27 v31.81,17.27
ETH_MDINT  (via drill 0.25)
  Top 0.152: U8.PA3 55.29,13.16 v54.67,13.14 | R16.2 23.92,19.62 | 23.92,19.62 R15.1 | 23.92,19.62 23.92,21.67 23.88,21.72 23.88,22.35 24.51,22.99 27.37,22.99 28.64,24.26 37.53,24.26 38.16,23.62 38.16,22.99 v38.48,22.67 | v54.36,22.67 v46.42,22.67
  Bottom 0.152: v54.67,13.14 54.67,22.35 v54.36,22.67 | v46.42,22.67 v38.48,22.67
ETH_MDIO  (via drill 0.25)
  Top 0.152: U3.16 29.75,13.62 v30.23,14.1 31.69,15.56 31.93,15.56 R44.2 | U8.PA2 55.28,10.32 v55.12,10.16
  Bottom 0.152: v30.23,14.1 30.23,13.78 30.54,13.46 33.4,13.46 34.67,12.19 38.48,12.19 39.43,11.24 39.43,8.7 40.77,7.37 44.2,7.37 46.23,9.4 52.32,9.4 53.34,10.41 54.86,10.41 v55.12,10.16
ETH_RXD0  (via drill 0.25)
  Top 0.152: U8.PC4 55.03,16.68 54.86,16.51 45.02,16.51 v44.83,16.57 | v44.83,8.7 40.07,8.7 39.37,9.4 36.32,9.4 34.35,11.37 R42.2 33.84,11.12 U3.11
  Bottom 0.152: v44.83,16.57 v44.83,8.7
ETH_RXD1  (via drill 0.25)
  Top 0.152: U8.PC5 56.29,17.18 55.56,17.91 v44.2,17.91 | v44.2,8.06 39.75,8.06 39.05,8.76 36.01,8.76 34.3,10.46 R43.2 33.94,10.62 U3.10
  Bottom 0.152: v44.2,17.91 v44.2,8.06
ETH_TX_EN  (via drill 0.25)
  Top 0.152: U8.PB11 55.86,24.18 55.63,23.94 55.63,19.81 55.31,19.49 v45.15,19.49 | v25.65,15.94 26.17,15.43 U3.21
  Bottom 0.152: v45.15,19.49 37.85,19.49 36.58,18.22 27.05,18.22 25.78,16.95 25.78,16.07 v25.65,15.94
ETH_TXD0  (via drill 0.25)
  Top 0.152: U8.PB12 55.28,25.18 53.72,23.62 44.51,23.62 44.2,23.3 44.2,20.77 v43.56,20.13 | U3.22 25.67,15.04 v24.51,15.88
  Bottom 0.152: v43.56,20.13 37.21,20.13 36.26,19.43 24.51,19.43 23.24,17.91 23.24,17.14 v24.51,15.88
ETH_TXD1  (via drill 0.25)
  Top 0.152: U8.PB13 54.78,25.31 53.72,24.26 43.24,24.26 42.93,23.94 v42.93,20.77 | v22.92,13.91 22.92,14.73 23.24,15.05 24.83,15.05 25.15,14.73 25.15,14.32 U3.23
  Bottom 0.152: v42.93,20.77 36.89,20.77 35.94,19.81 23.88,19.81 22.61,18.54 22.61,14.22 v22.92,13.91
GND  (via drill 0.25)  (180 unrouted)
  Top 0.152: U8.VSS2 57.82,13.68 v58.17,13.53 57.91,13.78 57.91,14.48 57.71,14.68 | U8.VSS1 47.78,12.28 v47.69,12.83 | U8.PDR_ON 42.51,13.68 v42.93,13.14 | v41.47,10.86 C49.1 | v15.94,12.51 C44.1 | U3.25 24.73,13.62 v25.65,12.7 | v19.43,11.24 19.43,10.94 C37.1 | C32.1 v26.42,1.59 | C31.1 v25.27,1.59 | C35.2 32.83,11.81 v33.15,11.75 | v25.53,22.1 26.86,22.04 C36.1 28.27,21.4 | C20.1 31.48,19.38 C10.1 31.48,22.02 v31.5,22.29 | v25.65,11.18 25.72,11.18 U3.GND
  other vias: 34.8,30.73 30.48,30.73 53.09,25.21 48.32,25.53 46.1,25.53 53.4,18.86 53.09,17.27 52.51,14.16 39.12,18.54 39.37,15.75 51.18,12.83 31.5,9.02 16.89,6.48 19.05,33.53 25.97,23.88 7.87,43.18 28.96,42.93 38.61,42.93 65.02,31.5 65.02,21.34 65.02,11.18 56.39,0.76 45.72,0.76 35.56,0.76 23.11,0.76 11.94,0.76 27.18,12.7 27.18,11.18 14.22,37.59 13.21,37.59 14.22,38.61 43.94,37.85 44.7,37.85 27.94,26.16 26.54,6.73 25.27,5.97 27.3,5.97 28.32,5.97 29.59,5.97 31.11,6.73 22.76,21.84 22.76,20.07 26.31,22.35 27.08,22.35 27.84,22.35 30.89,21.59 31.14,21.08 30.94,22.12 30.63,18.8 30.89,20.32 29.87,18.8 29.11,18.8 28.6,21.34 28.6,20.57 32.92,12.7 31.11,5.97 25.02,6.99 26.54,5.97 32.13,2.16 32.13,2.67 32.13,3.17 41.91,2.54 41.91,3.05 41.91,3.56 39.12,5.59 39.12,6.1 39.12,6.6 44.96,5.59 53.09,4.57 52.07,7.62 52.58,7.62 53.09,7.62 56.11,8.23 55.6,8.23 55.09,8.23 47.18,7.49 47.69,7.49 48.23,12.8 47.98,13.31 46.2,12.8 45.69,12.8 44.07,25.78 43.56,25.78 43.05,25.78 42.55,30.86 43.05,30.86 43.56,30.86 44.04,31.47 44.58,31.47 45.14,31.45 43.64,30.35 43.64,29.79 26.42,41.15 39.37,27.94 26.67,29.72 39.5,39.62 28.04,25.12 26.92,27.69 26.67,37.34 36.07,39.88 27.94,39.62 40.64,38.35 59.63,29.38 59.12,29.4 58.61,29.4 58.1,28.51 57.59,28.51 57.09,27.5 57.09,28 38.61,30.73 19.56,43.18 4.06,34.8 4.83,34.8 5.59,34.8 6.86,34.29 6.1,34.29 7.62,34.29 8.38,33.53 20.32,34.04 22.86,36.07 23.62,36.07 22.1,36.07 36.07,36.83
  pour GND (isolate 0.254, no thermals): 0,43.94 0,0 89.66,0 89.66,43.94
  pour Top (isolate 0.254, rank 6): 65.79,43.94 0,43.94 0,0 65.79,0
  pour SUPPLY (isolate 0.254, rank 6, no thermals): 0,0 89.66,0 89.66,43.94 0,43.94
  pour Bottom (isolate 0.254, rank 6): 0,43.94 0,0 65.79,0 65.79,43.94
  pour Top (isolate 0.254, rank 5, no thermals): 24.64,42.93 24.64,24.64 3.05,24.64 3.05,42.93
LED2
  Top 0.254: U8.PD11 51.78,28.15 52.07,28.45 LED2.C
LED3  (1 unrouted)
  Top 0.254: U8.PD13 50.78,29.2
LED4
  Top 0.254: U8.PD14 50.28,27.96 49.53,28.7 LED4.C
N$2
  Top 0.254: LED4.A R39.2
N$3
  Top 0.254: LED3.A R38.2
N$4
  Top 0.254: LED2.A R40.2
N$6
  Top 0.254: C21.1 U10.5
N$7
  Top 0.254: U10.6 16.29,28.24 R1.1 C26.2 16.33,26.75 16.26,26.67 R3.2
N$8
  Top 0.152: L1.1 6.33,21.74 J3.T+@13 J3.T+@14
N$9
  Top 0.152: U8.BOOT0 40.88,16.18 TP1.TP
N$10
  Top 0.254: R7.2 U10.2 11.18,30.73
N$15
  Top 0.152: R11.1 18.64,12.66 18.49,12.51 C44.2 18.49,12.19 20.07,12.19 21.32,10.94 R10.1
N$19
  Top 0.254: LED1.C R6.2
N$20
  Top 0.152: L1.2 16.34,14.33 16.26,14.41 6.41,21.02 J3.T-@11
  Bottom 0.152: J3.T-@9 J3.T-@11
N$26
  Top 0.152: J3.R+@7 J3.R+@5 6.41,16.57 15.62,9.97 16.26,10.6 16.66,10.69 L4.1
N$27
  Top 0.152: J3.R-@4 J3.R-@3 6.41,15.94 16.05,9.34 L4.2
N$28
  Top 0.152: T1.1 19.22,15.9 L1.4
N$29
  Top 0.152: L1.3 18.37,14.41 17.84,14.41 17.53,14.73 17.53,15.37 18.38,15.91 18.52,16.04 T1.2
N$30
  Top 0.152: L4.4 17.93,10.69 17.53,10.29 17.53,9.65 16.57,8.7 16.26,8.7 16.26,7.95 T2.1
N$31
  Top 0.152: T2.2 16.85,8.29 L4.3
N$32  (via drill 0.25)
  Top 0.152: v20.07,16 20.07,15.05 R11.2 | v19.75,19.81 19.11,20.62 T1.6
  Bottom 0.152: v19.75,19.81 19.75,16.32 v20.07,16
N$33
  Top 0.152: T2.6 16.49,3.84 R10.2
N$40
  Top 0.152: T2.4 18.9,4.69 R22.1 20.69,7.1 21.65,8.06 21.78,8.06 22.1,8.38 22.1,10.6 22.62,11.12 U3.30
N$41
  Top 0.152: T1.5 17.17,19.22 | 17.17,19.22 17.21,18.86 17.84,17.91 19.75,17.91 20.7,16.95 20.7,12.19 21.27,11.62 U3.29 | 17.17,19.22 16.81,19.81 16.26,19.81 15.94,20.13 15.94,21.72 16.57,22.35 20.32,22.35 20.91,21.77 R25.1
N$42
  Top 0.152: T1.4 16.47,21.61 16.57,21.72 17.84,21.72 | 17.84,21.72 17.84,19.18 18.48,18.54 19.75,18.54 21.34,16.95 21.34,12.51 21.72,12.12 U3.28 | 17.84,21.72 19.75,21.72 20.69,20.78 20.69,20.46 R24.1
N$44
  Top 0.152: T2.5 18.2,3.26 18.8,2.67 19.11,2.67 19.43,2.98 19.43,3.62 20.07,4.25 21,4.25 R23.1 | R23.1 21.32,4.27 21.34,4.25 | U3.31 23.07,10.62 22.73,10.29 22.73,7.94 24.38,6.29 24.38,4.25 23.56,3.3 21.97,3.3 21.34,3.94 21.34,4.56 R23.1
N$55
  Top 0.152: U3.32 23.59,10.12 23.37,9.91 23.37,8.38 24.13,7.62 25.61,7.62 R29.2
N$56  (via drill 0.25)
  Top 0.152: T2.3 18.56,8.78 v18.8,9.02 20.05,9.02 C37.2 | v17.53,17.27 17.35,17.27 T1.3 | v18.8,19.18 R20.1 20.95,19.23
  Bottom 0.152: v18.8,9.02 17.84,9.02 17.53,9.34 v17.53,17.27 17.53,17.91 v18.8,19.18
N$58
  Top 0.152: U3.6 27.17,8.84 27.37,8.64 27.37,7.75 27.24,7.62 27.17,7.56 C53.2 C34.2
N$63
  Top 0.152: U3.18 27.67,14.94 27.88,15.11 27.88,16 27.5,16.38 27.24,16.38 26.35,17.27 26.1,17.27 25.03,18.59 R15.2
OSC_IN
  Top 0.152: U8.PH0 48.78,4.58 48.26,4.06 46.82,4.06 X1.3
  Top 0.254: C30.2 X1.3
OSC_OUT
  Top 0.152: U8.PH1 49.28,6.86 49.78,6.35 51.1,6.35 X1.1
  Top 0.254: C29.2 51.64,6.27 51.56,6.35 51.29,6.35 X1.1
OTG_FS_DM
  Top 0.254: USB.P2 46.12,28.34 45.78,28 U8.PA11
OTG_FS_DP
  Top 0.254: USB.P3 45.47,28.45 45.28,28.26 U8.PA12
OTG_FS_VBUS  (via drill 0.25)  (7 unrouted)
  Top 0.254: USB.P1 | U8.PA9 46.78,35.35 46.99,35.56 v46.99,36.83
  Bottom 0.127: 12.95,26.16 12.95,26.42 v13.21,26.67
  Bottom 0.762: v46.99,36.83 40.13,36.83 38.61,38.35 22.1,38.35 12.95,29.21 12.95,26.16
  other vias: 47.75,37.59 47.75,36.83 12.45,26.67 12.45,25.65 13.21,25.65
  pour Top (isolate 0.254, no thermals): 46.48,39.88 46.48,36.58 46.48,36.32 48.51,36.32 48.51,39.88
  pour Top (isolate 0.254, no thermals): 10.92,26.92 13.46,26.92 13.46,25.4 10.92,25.4
  pour Bottom (isolate 0.254, no thermals): 12.19,26.92 13.46,26.92 13.46,25.4 12.19,25.4
  pour Bottom (isolate 0.254, no thermals): 46.74,37.85 48.01,37.85 48.01,36.32 46.74,36.32
PE0
  Top 0.152: R12.1 36.91,20.02 | 36.91,20.02 Q1.1 | 36.91,20.02 37.01,20.02 37.85,19.18 37.85,15.68 38.85,14.68 U8.PE0
PHY_CLK_25MHZ  (via drill 0.25)
  Top 0.152: U8.PA8 v47.28,25.62 | v46.1,9.97 42.86,9.97 42.67,10.16 41.66,10.16 41.4,9.91 40.2,9.91 39.62,10.92 v35.62,10.92 | U3.5 26.67,8.44 v26.61,8.38
  Bottom 0.152: v26.61,8.38 33.34,8.38 33.34,8.64 v35.62,10.92 | v47.28,25.62 47.28,13.37 47.05,13.14 47.05,10.92 | 47.05,10.92 v46.1,9.97 | 47.05,10.92 56.58,10.92
PHYAD0
  Top 0.152: R46.1 30.48,12.95 29.65,12.12 U3.13
PHYAD1
  Top 0.152: U3.7 27.67,8.97 28.51,8.13 29.04,8.13 R47.1
PHYAD2
  Top 0.152: U3.8 28.17,9.11 28.64,8.64 29.65,8.64 30.16,8.13 R48.1
RMIISEL
  Top 0.152: U3.9 29.07,10.12 R27.2
SDIO_CLK  (via drill 0.25)
  Top 0.152: U8.PC12 39.88,23.18 v38.8,23.62 | SD1.P5 34.88,36.75 v34.99,36.64
  Bottom 0.152: v38.8,23.62 38.8,29.15 38.86,29.21 34.99,33.08 v34.99,36.64
SDIO_CMD  (via drill 0.25)
  Top 0.152: v37.53,26.8 32.64,26.8 v32,27.43 | v38.16,21.72 41.49,21.72 U8.PD2 | SD1.P3 32.68,36.49 v32.51,36.32
  Bottom 0.152: v37.53,26.8 37.53,22.35 v38.16,21.72 | v32,27.43 32,35.81 v32.51,36.32
SDIO_D0  (via drill 0.25)
  Top 0.152: v40.64,28.96 40.64,31.5 39.12,32.89 39.12,34.54 38.35,35.31 38.1,35.31 37.08,36.32 SD1.P7 | U8.PC8 48.28,28.43 v48.26,28.45
  Bottom 0.152: v48.26,28.45 45.47,28.45 45.21,28.7 41.15,28.7 v40.64,28.96
SDIO_D1  (via drill 0.25)
  Top 0.152: U8.PC9 47.78,28.22 47.75,30.99 v47.75,31.24 | SD1.P8 38.18,36.49 v38.23,36.45
  Bottom 0.152: v47.75,31.24 46.48,32.51 39.12,32.51 39.12,35.56 v38.23,36.45
SDIO_D2
  Top 0.152: U8.PC10 40.78,24.18 40.07,24.89 29.59,24.89 29.27,25.21 29.27,29.34 29.04,29.57 29.04,35.13 30.48,36.58 SD1.P1
SDIO_D3  (via drill 0.25)
  Top 0.152: v40.07,25.84 31.18,25.84 30.54,26.48 30.54,29.4 29.72,30.23 29.72,34.54 31.5,36.32 31.5,38.27 SD1.P2 | U8.PC11 40.33,23.68 v40.07,23.94
  Bottom 0.152: v40.07,23.94 v40.07,25.84
SHLD
  Top 0.254: C62.2 41.88,41.83 USB.P$1
  Bottom 0.152: USB.P$1 41.96,40.25 USB.P$4 43.04,40.25 43.69,40.89 46.99,40.89 47.75,40.13 47.75,39.3 USB.P$3 48.98,40.25 USB.P$2
TCK  (via drill 0.25)
  Top 0.152: v41.66,33.53 41.66,25.31 U8.PA14 | v48.26,33.53 48.26,35.31 50.29,37.34 55.12,37.34 55.37,37.59 J1.SWDCLK
  Bottom 0.152: v48.26,33.53 v41.66,33.53
TDI  (via drill 0.25)
  Top 0.152: U8.PA15 50.33,24.68 v51.56,24.89
  Bottom 0.152: v51.56,24.89 51.56,34.29 52.83,35.56 J1.NC
TDO  (via drill 0.25)
  Top 0.152: U8.PB3 51.95,18.68 v52.13,18.86
  Bottom 0.152: v52.13,18.86 52.13,34.35 54.1,36.32 J1.SWO 54.1,39.62
TMS  (via drill 0.25)
  Top 0.152: U8.PA13 44.78,25.9 v45.15,25.53 | v50.55,36.83 56.13,36.83 56.64,37.34 J1.SWDIO
  Bottom 0.152: v45.15,25.53 45.15,26.8 46.1,27.75 49.85,27.75 50.55,28.45 v50.55,36.83
VDD  (via drill 0.25)
  Top 0.152: Q1.3 35.5,17.27 33.72,17.27 32.83,18.16 C20.2 32.83,19.33 32.78,19.38 C10.2 32.77,21.1 v32.77,22.61 | v33.08,34.1 33.78,35.05 SD1.P4
  Bottom 0.152: v33.08,34.1 33.08,22.92 v32.77,22.61
VDDA  (via drill 0.25)
  Top 0.152: U3.1 24.67,8.54 v24.51,8.38 | R22.2 v22.92,6.48 | R23.2 v23.56,4.7 | U3.27 22.4,12.62 v22.09,12.94 22.09,19.08 R20.2 R24.2 R25.2 | v25.08,4.7 25.27,4.38 C31.2 C32.2 27.67,3.06 C23.2 28.45,1.91 28.96,1.4 33.72,1.4 34.04,1.71 34.04,2.91 L3.1
  Bottom 0.152: v22.09,12.94 22.11,12.94 24.19,11.81 24.19,8.7 v24.51,8.38 24.26,8.06 v22.92,6.48 23.56,5.84 v23.56,4.7 v25.08,4.7
VIN  (via drill 0.25)  (15 unrouted)
  Top 0.254: R7.1 9.69,27.51
  other vias: 4.06,29.72 4.83,29.72 5.59,29.72 6.35,29.72 7.11,29.72 7.87,29.72 8.38,30.99 8.64,29.72
  pour SUPPLY (isolate 0.254, no thermals): 10.41,22.61 10.41,32 3.05,32 3.05,22.61
  pour Top (no thermals): 10.41,22.61 10.41,32 3.05,32 3.05,22.61
  pour Bottom (no thermals): 10.41,22.61 10.41,32 3.05,32 3.05,22.61

### Text on the board
tNames: GPS RF FRONT-END BOARD V2 / FEB 2014, Portland State Aerospace / JENNER HANNI and ANDREW GREENBERG